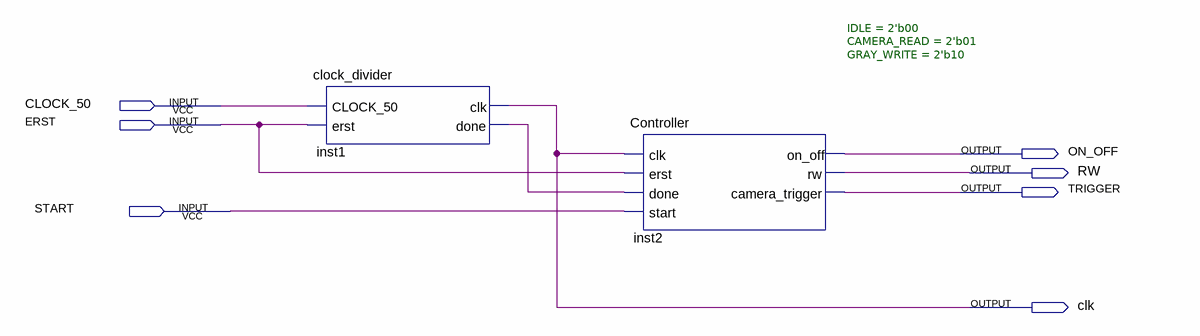
[diagram p0: schematic sheet]
// Quartus schematic FSM_tester.bdf as structural Verilog: 2 symbols, 7 pins
module FSM_tester (
  input  CLOCK_50,
  input  ERST,
  input  START,
  output ON_OFF,
  output RW,
  output TRIGGER,
  output clk
);

  wire inst1_done;

  clock_divider inst1 (.CLOCK_50(CLOCK_50), .erst(ERST), .clk(clk), .done(inst1_done));
  Controller #(.IDLE(2'b00), .CAMERA_READ(2'b01), .GRAY_WRITE(2'b10)) inst2 (
    .clk(clk), .erst(ERST), .done(inst1_done), .start(START), .on_off(ON_OFF), .rw(RW),
    .camera_trigger(TRIGGER));
endmodule
